# Altium project SiC431_Buck_24V_to_3V3.PrjPcb
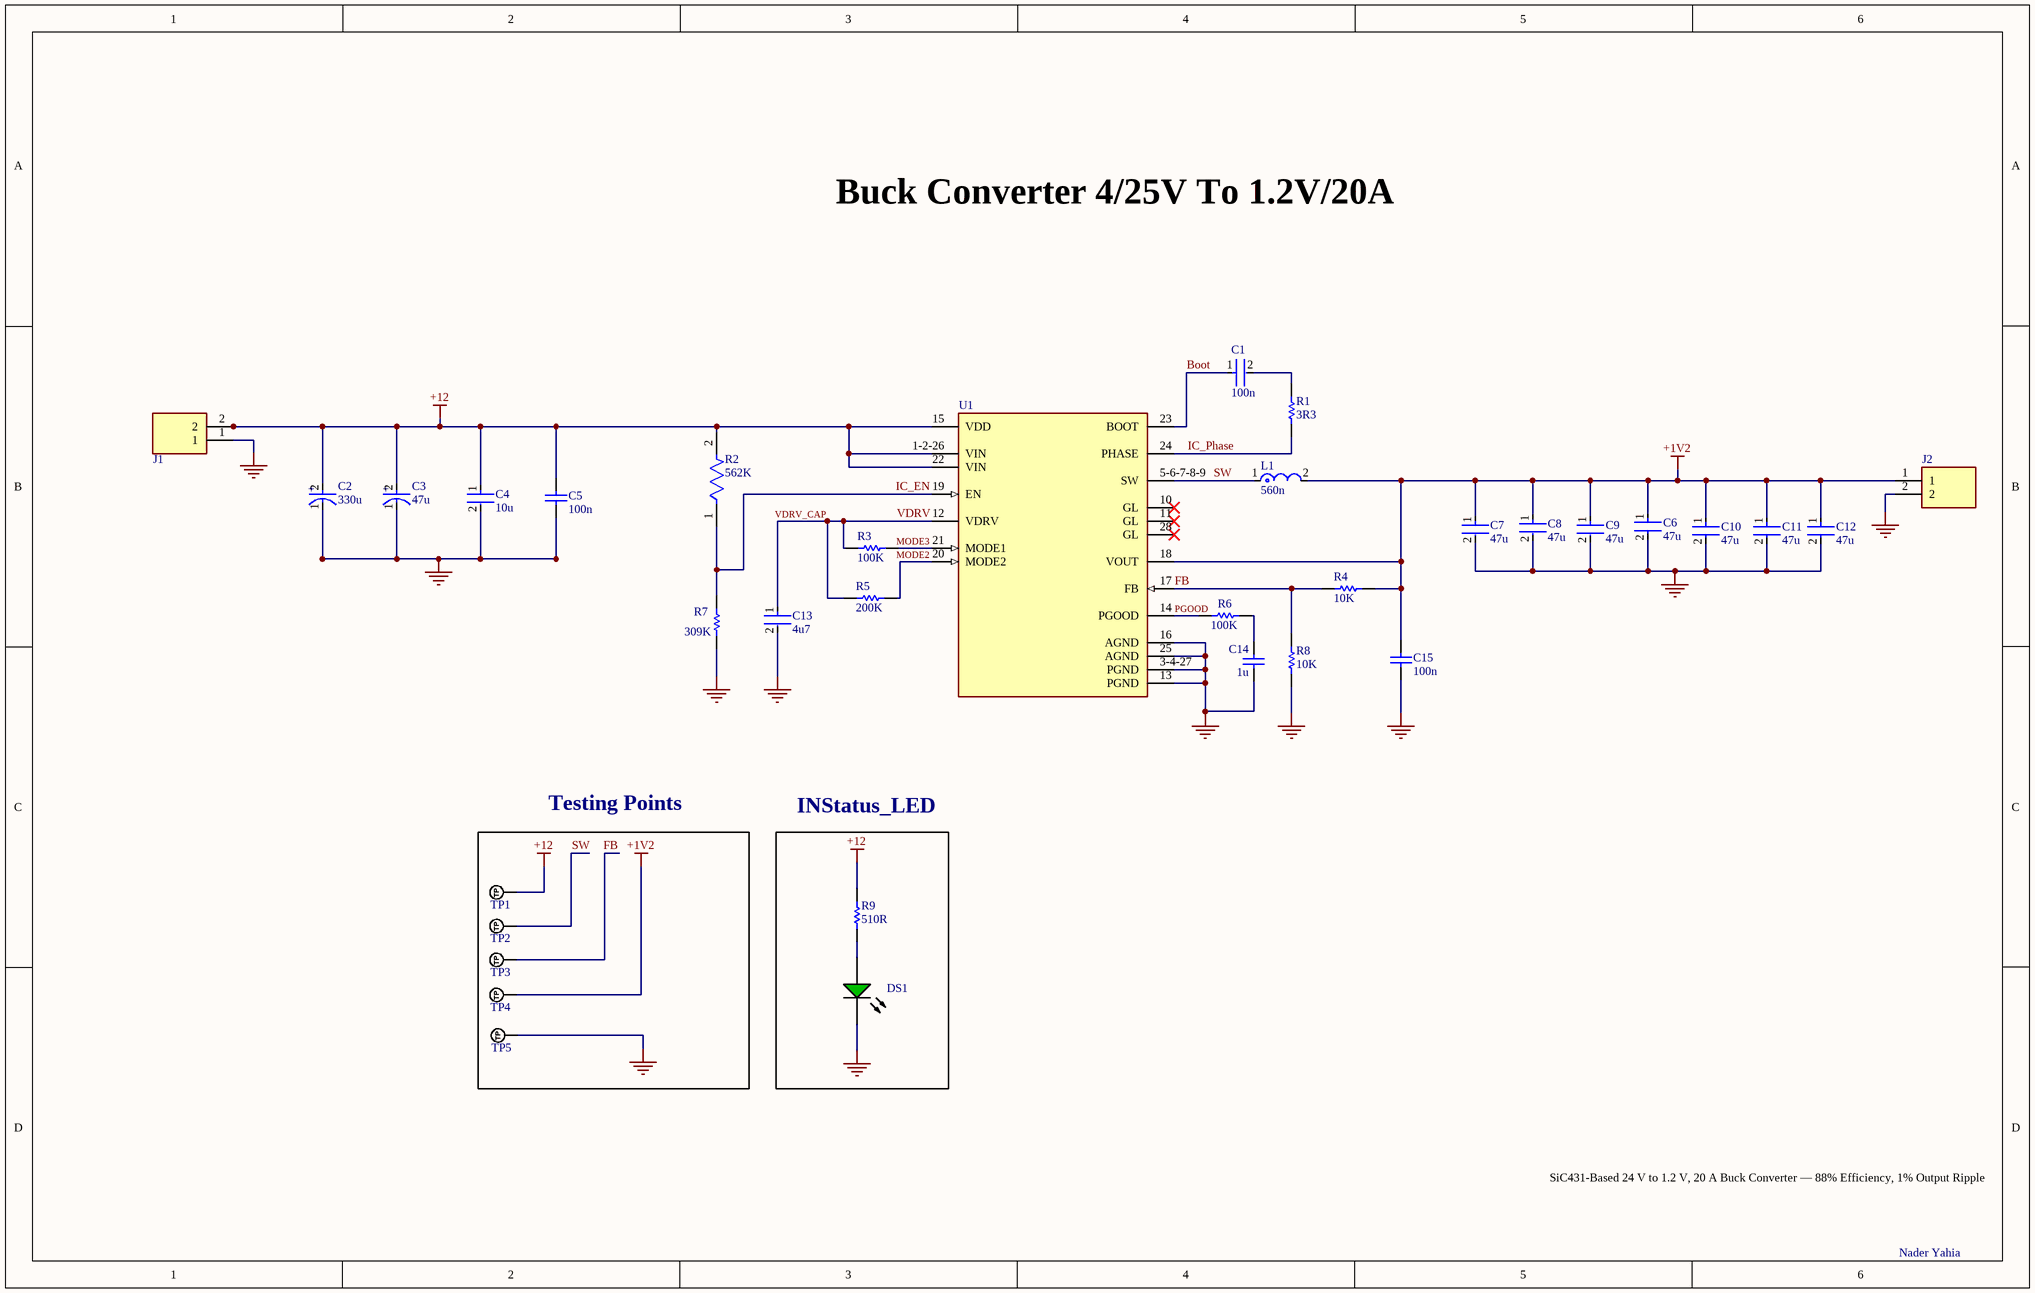
[diagram p0: Sheet1.SchDoc]
1 sheet, 34 parts. Net scope: global (net labels, ports and power ports of the same name join across sheets).
Board file: PCB2.PcbDoc

## Sheet Sheet1.SchDoc
size B; SheetNumber: 1; SheetTotal: 1

### Parts
C1  100n  [FP-C0402-BB-MFG]
C2  330u  [FP-PCR1V331MCL1GS-MFG]
C3  47u  [FP-FPD-MFG]
C4  10u  [FP-CL32-IPC_C]
C5  100n  [CAPC1608X95X40NL15T15]
C6  47u  [FP-GRM32E-0_3-0_2-IPC_A]
C7  47u  [FP-GRM32E-0_3-0_2-IPC_A]
C8  47u  [FP-GRM32E-0_3-0_2-IPC_A]
C9  47u  [FP-GRM32E-0_3-0_2-IPC_A]
C10  47u  [FP-GRM32E-0_3-0_2-IPC_A]
C11  47u  [FP-GRM32E-0_3-0_2-IPC_A]
C12  47u  [FP-GRM32E-0_3-0_2-IPC_A]
C13  4u7  [FP-CC0603-DA-MFG]
C14  1u  [CAPC1608X95X40NL15T15]
C15  100n  [CAPC1608X95X40NL15T15]
DS1  LTST-C170KGKT  [LTST-LTST-C170KGKT-2_V]  (value not drawn)
J1  TB005-762-02BE  [TB00576202BE]  (value not drawn)
J2  TB005-762-02BE  [TB00576202BE]  (value not drawn)
L1  560n  [FP-FCUL1060-MFG]
R1  3R3  [RESC1005X40X25LL05T10]
R2  562K  [FP-CRCW0402-e3-MFG]
R3  100K  [RESC1005X40X25NL05T10]
R4  10K  [RESC1609X50X30NL8T20]
R5  200K  [RESC1005X40X25LL05T10]
R6  100K  [RESC1005X40X25NL05T10]
R7  309K  [RESC1005X40X25LL05T10]
R8  10K  [RESC1609X50X30NL8T20]
R9  510R  [RESC3116X65X40LL10T20]
TP1  TP_VIN  [PAD_RND_1MM]  (value not drawn)  (no BOM)
TP2  TP_NOBOM  [PAD_RND_1MM]  (value not drawn)  (no BOM)
TP3  TP_NOBOM  [PAD_RND_1MM]  (value not drawn)  (no BOM)
TP4  TP_NOBOM  [PAD_RND_1MM]  (value not drawn)  (no BOM)
TP5  TP_NOBOM  [PAD_RND_1MM]  (value not drawn)  (no BOM)
U1  SIC431AED-T1-GE3  [FP-T22-0442-MFG]  (value not drawn)

### Blocks framed on the sheet
Testing Points: TP1-TP5
INStatus_LED: DS1 R9

### Nets
+1V2: C6.1 C7.1 C8.1 C9.1 C10.1 C11.1 C12.1 C15.2 J2.1 L1.2 R4.1 TP4.1(TP) U1.18(VOUT)
+12: C2.2(A) C3.2(A) C4.1 C5.2 J1.2 R2.2 R9.2 TP1.1(TP) U1.1-2-26(VIN) U1.15(VDD) U1.22(VIN)
GND: C2.1(C) C3.1(C) C4.2 C5.1 C6.2 C7.2 C8.2 C9.2 C10.2 C11.2 C12.2 C13.2 C14.1 C15.1 DS1.1(K) J1.1 J2.2 R7.1 R8.1 TP5.1(TP) U1.3-4-27(PGND) U1.13(PGND) U1.16(AGND) U1.25(AGND)
Boot: C1.1 U1.23(BOOT)
FB: R4.2 R8.2 TP3.1(TP) U1.17(FB)
IC_EN: R2.1 R7.2 U1.19(EN)
IC_Phase: R1.1 U1.24(PHASE)
MODE2: R5.1 U1.20(MODE2)
MODE3: R3.2 U1.21(MODE1)
PGOOD: R6.1 U1.14(PGOOD)
SW: L1.1 TP2.1(TP) U1.5-6-7-8-9(SW)
VDRV: C13.1 R3.1 R5.2 U1.12(VDRV)  [also labelled VDRV_CAP]
NetC1_2: C1.2 R1.2
NetC14_2: C14.2 R6.2
NetDS1_2: DS1.2(A) R9.1

Not connected (* = marked no-connect by the designer): U1 10(GL)* 11(GL)* 28(GL)*

### Notes on the sheet
- Buck Converter 4/25V To 1.2V/20A
- SiC431-Based 24 V to 1.2 V, 20 A Buck Converter — 88% Efficiency, 1% Output Ripple
- Nader Yahia
- (in symbol CMP-2000-06216-2) +
- (in symbol CMP-12462-000009-1) +

### Library data of the parts
C1 = CMP-03020-000918-1: C0402 0.10 μF X5R 10.00% 10 V; Manufacturer_Part_Number: C0402C104K8PAC; Manufacturer: Kemet; Value: 0.10 μF; Voltage Rating: 10 V; Temperature Coefficient: 15%; Material: Ceramic; Tolerance: 0.1; Device Class L1: Passive Components; ComponentLink2URL: https://content.kemet.com/datasheets/KEM_C1002_X7R_SMD.pdf; RoHS: TRUE; Capacitance: 0.10 μF; Category: Cap; Lead Free: Yes; Octopart: https://octopart.com/c0402c104k8pac-kemet-2645080; Mouser Description: Cap-fxd 0.1UF +-10PCT 10V Cer X5R 0402 S; Device Class L2: Capacitors; Ipc Land Pattern Name: CAPC10050X50; Temperature Characteristic: X5R; Device Class L3: Ceramic Capacitors; Temperature Range High: +125°C; Package: C0402-BB; Temperature Range Low: -55°C; Automotive: No; Height: 0.55mm; ComponentLink2Description: Datasheet; Temperature: -55°C to +125°C
C2 = CMP-12462-000009-1: CAP ALUM POLY 330UF 20% 35V SMD; Manufacturer: Nichicon; Manufacturer_Part_Number: PCR1V331MCL1GS; Ripple Current: 3900mA; Esr: 16mΩ; Automotive Grade: Grade 1; Leakage Current: 346.5uA; Material: Aluminum; Life: 4000Hours; Dissipation Factor: 8%; Temperature: -55°C to +125°C; Automotive: Yes; Device Class L1: Passive Components; Lead Free: Yes; Package: 0; Device Class L2: Capacitors; Value: 330uF; Octopart: https://octopart.com/pcr1v331mcl1gs-nichicon-34508554; Footprint Url: https://products.nichicon.co.jp/en/pdf/XJA042/e-p_ref.pdf; ComponentLink2URL: https://products.nichicon.co.jp/en/pdf/XJA042/e-pcr.pdf; Device Class L3: Aluminum Electrolytic Capacitors; Temperature Range Low: -55°C; Digikey Description: CAP ALUM POLY 330UF 20% 35V SMD; Height: 12.7mm; ComponentLink2Description: Datasheet; Capacitance: 330uF; Voltage Rating: 35V; Temperature Range High: +125°C; Tolerance: 20%; Category: Cap; RoHS: TRUE
C3 = CMP-2000-06216-2: CAP ALUM 47UF 20% 35V SMD; Manufacturer_Part_Number: EEE-FP1V470AP; Life (Hours): 2000Hour; Leakage Current: 3uA; Dissipation Factor: 0.12%; Material: Aluminium; Ripple Current (AC): 300mA; ESR (Equivalent Series Resistance): 260mR; Construction: Cylindrical; Contact Plating: Tin; Termination: SMD/SMT; RoHS Compliant: Yes; Voltage Rating (DC): 35V; Package Quantity: 1; Tolerance: 20%; Mount: Surface Mount; Diameter: 6.3mm; Lead Free: Lead Free; Number of Pins: 2; Radiation Hardening: No; Series: FP; REACH SVHC: No SVHC; Length: 5.8mm; Height - Seated (Max): 0.228inch; Capacitance: 47uF; Packaging: Tape and Reel; Voltage Rating: 35V; Min Operating Temperature: -55°C; Voltage: 35V; Case/Package: Radial; Max Operating Temperature: 105°C; Ripple Current: 300mA; Height: 5.8mm; Lead Pitch: 1.8mm
C4 = CMP-2000-06110-2: Cap Ceramic 10uF 50V X7R ±10% SMD 1210 +125°C Embossed T/R; Manufacturer_Part_Number: CL32B106KBJNNNE; Material: Ceramic; Min Operating Temperature: -55°C; Depth: 2.5mm; Radiation Hardening: No; Capacitance: 10uF; Packaging: Tape and Reel; Dielectric: X7R; Case Code (Metric): 3225; Height: 2.5mm; Thickness: 0.106inch; Voltage Rating (DC): 50V; Voltage Rating: 50V; Width: 0.098inch; Case Code (Imperial): 1210; Length: 3.2mm; Tolerance: 10%; Lead Free: Lead Free; Package Quantity: 1; Voltage: 50V; Mount: Surface Mount; Case/Package: 1210; Max Operating Temperature: 125°C
C5 C15 = CMP-1035-02584-2: Manufacturer: Vitramon; Manufacturer_Part_Number: VJ0603Y104KXJCW1BC
C6-C12 = CMP-1662-00023-3: Chip Multilayer Ceramic Capacitors for General Purpose, 1210, 47uF, X7R, 15%, 10%, 10V; Manufacturer_Part_Number: GRM32ER71A476KE15L; Voltage Rating: 10V; Case Code (Metric): 3225; REACH SVHC: No SVHC; Depth: 2.5mm; Termination: SMD/SMT; Width: 2.5mm; Number of Pins: 2; Mount: Surface Mount; Case Code (Imperial): 1210; Package Quantity: 1; Thickness: 0.106inch; Height: 2.5mm; Length: 3.2mm; Case/Package: 1210; Packaging: Tape and Reel; Lead Free: Lead Free; Radiation Hardening: No; Dielectric: X7R; Tolerance: 10%; Max Operating Temperature: 125°C; Voltage: 10V; Material: Ceramic; Capacitance: 47uF; Min Operating Temperature: -55°C; Voltage Rating (DC): 10V
C13 = CMP-03422-000495-1: CAP CER 4.7UF 6.3V X5R 0603; Manufacturer_Part_Number: CC0603KRX5R5BB475; Manufacturer: YAGEO; Tolerance: 0.1; Temperature Coefficient: 15%; Material: Ceramic; Voltage Rating: 6.3 V; Height: 0.9mm; Temperature Characteristic: X5R; Value: 4.7 uF; ComponentLink2Description: Datasheet; Mouser Description: Multilayer Ceramic Capacitor, CC Series, 4.7 - F, - 10%, X5R, 6.3 V, 0603 [1608 Metric]; Voltage: 6.3 V; Device Class L3: Ceramic Capacitors; Temperature: -55°C to +125°C; Octopart: https://octopart.com/cc0603krx5r5bb475-yageo-42244632; Digikey Description: CAP CER 4.7UF 6.3V X5R 0603; Package: CC0603-DA; Device Class L2: Capacitors; Category: Cap; Footprint Url: http://www.yageo.com/exep/pages/download/literatures/UPY-C_GEN_24.pdf; ComponentLink2URL: http://www.yageo.com/documents/recent/UPY-GPHC_X7R_6.3V-to-50V_18.pdf; Temperature Range High: +125°C; Automotive: No; Temperature Range Low: -55°C; Lead Free: Yes; Capacitance: 4.7 uF; Device Class L1: Passive Components; RoHS: TRUE
C14 = CMP-2006-00046-1: Manufacturer: Vitramon; Manufacturer_Part_Number: VJ0603G105KXYCW1BC
DS1 = CMP-2000-06620-1: Ultra Bright AlInGaP Chip LED, 75 mW, -55 to 85 degC, 2-Pin SMD (0805), RoHS, Tape and Reel; Manufacturer: Lite-On; Forward Current: 30mA; Power Dissipation Max: 75mW; Emitting Color: YellowGreen; Type: Uni-Color; Forward Voltage: 2.4V; Dominant Wave Length: 571nm; Test Current (It): 20mA; Product Length (mm): 2mm; Peak Wavelength: 574nm; Power Dissipation: 75W; Product Depth (mm): 1.25mm; DELETED: Compliant; High Brightness: Yes; Product Height (mm): 1.1mm; Luminous Intensity: 35mcd; Shape Type: Rectangular; Chip Material: AlGaInP; Viewing Angle: 130deg; Number of  Elements: 1; Reverse Voltage: 5V; Rad Hardened: No; Package Type: ChipLed; Manufacturer URL: http://www.us.liteon.com/; Mounting: SurfaceMount; Operating Temp Range: -55Cto85C; Datasheet URL: http://optoelectronics.liteon.com/upload/download/DS22-2000-073/S_110_LTST-C170KGKT.pdf; Packaging: TapeandReel; Pin Count: 2; Package Description: 2-Pin Surface Mounted Device, Body 2 x 1.25 mm; Mounting Technology: SurfaceMount; Package Reference: LTST-C170KGKT-2; Forward Current Max: 30mA; Datasheet Version: Rev. G, 06/2005; Lens Dimensions: 1.4x1.25x0.6mm; Operating Temperature Classification: Industrial; Lum Intensity: 35mcd; Main Category: ChipLED; Manufacturer_Part_Number: LTST-C170KGKT
J1 J2 = TB005-762-02BE: Connector; Manufacturer_Name: Same Sky; Datasheet Link: https://www.sameskydevices.com/product/resource/supplyframepdf/tb005-762.pdf; Height: 21.7mm; Manufacturer_Part_Number: TB005-762-02BE; Mouser Part Number: 490-TB005-762-02BE; Mouser Price/Stock: https://www.mouser.co.uk/ProductDetail/Same-Sky/TB005-762-02BE?qs=vLWxofP3U2zXv1H2wuShow%3D%3D; Arrow Part Number: TB005-762-02BE; Arrow Price/Stock: https://www.arrow.com/en/products/tb005-762-02be/cui-devices?utm_currency=USD&region=nac
L1 = CMP-06042-016308-1: FIXED IND; Manufacturer_Part_Number: FCUL1060-H-R56M=P3; RoHS Compliant: Yes
R1 = CMP-2002-07619-1: Manufacturer_Part_Number: RC0402FR-0733RL; Manufacturer: Yageo / Phycomp
R2 = CMP-2002-00099-2: RES Thick Film, 562kΩ, 1%, 0.063W, 100ppm/°C, 0402; Manufacturer_Part_Number: CRCW0402562KFKED; Power Rating: 63mW; Resistance: 562kR; Voltage Rating (DC): 50V; Height: 0.35mm; Packaging: Tape and Reel; Package Quantity: 10; Military Standard: Not; Radiation Hardening: No; Features: Automotive AEC-Q200; Lead Free: Lead Free; Weight: 2.3E-05oz; Length: 1mm; Termination: SMD/SMT; Case/Package: 0402; Max Power Dissipation: 63mW; Tolerance: 1%; Mount: Surface Mount; Case Code (Imperial): 0402; Max Operating Temperature: 155°C; Depth: 0.5mm; Temperature Coefficient: 100ppm/°C; Composition: Thick Film; Min Operating Temperature: -55°C; Contact Plating: Tin; Voltage Rating: 50V; Width: 0.02inch; Case Code (Metric): 1005; Number of Terminations: 2; Number of Pins: 2
R3 R6 = CMP-2002-07343-1: Manufacturer_Part_Number: RC0402FR-07100KL; Manufacturer: Yageo / Phycomp
R4 R8 = CMP-1666-00005-4: Chip Resistor, 10 KOhm, +/- 1%, 100 mW, -55 to 155 degC, 0603 (1608 Metric), RoHS, Tape and Reel; Manufacturer: Vishay Semiconductor; Manufacturer_Part_Number: CRCW060310K0FKEA; Voltage Rating: 75 V; Max Operating Temperature: 155 degC; PackageDescription: 2-Pin Surface Mount Device, Body 1.575 x 0.85 mm; ComponentLink1Description: Manufacturer URL; RoHSCompliant: true; PackageReference: 0603; REACH SVHC: Unknown; Length: 1.55 mm; DatasheetVersion: 06/2012; Packaging: Tape and Reel; Min Operating Temperature: -55 degC; Mounting Technology: Surface Mount; ComponentLink2URL: https://datasheet.ciiva.com/11809/0900766b80d98afc-11809037.pdf; Height: 0.45 mm; ComponentLink2Description: Datasheet; Package Quantity: 5000; ComponentLink1URL: http://www.vishay.com/
R5 = CMP-2002-07497-1: Manufacturer_Part_Number: RC0402FR-07200KL; Manufacturer: Yageo / Phycomp
R7 = CMP-2002-07598-1: Manufacturer: Yageo; Manufacturer_Part_Number: RC0402FR-07309KL
R9 = CMP-2003-03988-1: Manufacturer_Part_Number: RC1206JR-07510RL; Manufacturer: RC1206JR-07510RL
TP1-TP5 = TEST_POINT_RND_1MM: Test Point Round 1mm (NO BOM)
U1 = CMP-00030-87948104-1: SIC431AED-T1-GE3 IC Reg Buck Adj 24A MLP44-24; Max Supply Voltage: 24V; Number of Outputs: 1; Max Junction Temperature (Tj): 125°C; Min Supply Voltage: 3V; Output Voltage: 20V; NexarPartId: 87948104; Min Operating Temperature: -40°C; Schedule B: 8542390000, 8542390000; RoHS: Non-Compliant; Max Operating Temperature: 125°C; Height: 800µm; Ambient Temperature Range High: 105°C; Output Current: 24A; Manufacturer_Part_Number: SIC431AED-T1-GE3